# Altium schematic sheet 1_P1.schdoc
size 307 x 218 mm; Symbol: Drawing-Symbol_A4; Device: Drawing-Symbol_A4; @Project Name: smallest-microcontroller; @Page Count: 1; @Update Date: 2025-07-28; @Create Date: 2025-07-28; @Schematic Name: Schematic1; @Page No: 1; @Page Name: P1; Company: EasyEDA.com; Version: V1.0; Page Size: A4; @Create Time: 10:00:59; @Update Time: 11:22:58; Width: 1170; Height: 825; Region Start: 1; X Region Count: 6; Y Region Count: 4; Blade Width: 10; Title Block Position: 3; @Board Name: Board1
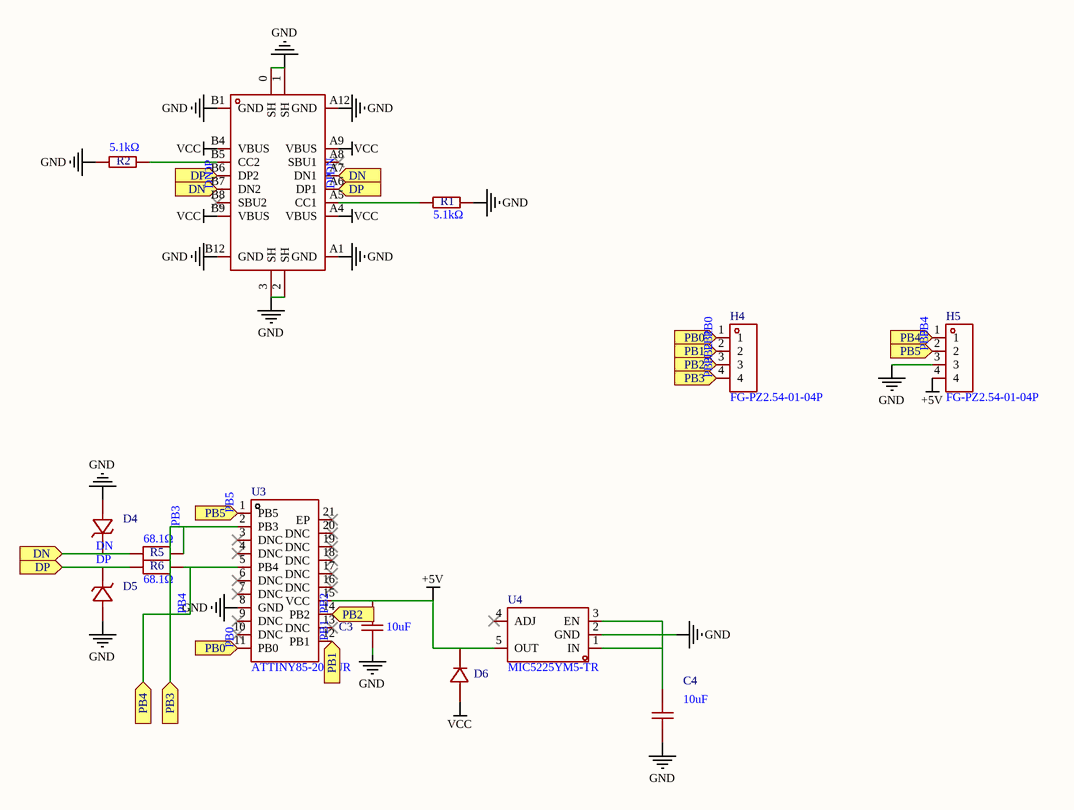
[diagram p0: 1_P1.schdoc]

## Parts
C3  10uF  [C0402]
C4  10uF  [C0402]
D4  BZT52C3V6  [SOD-123_L2.7-W1.6-LS3.7-RD-1]  (value not drawn)
D5  BZT52C3V6  [SOD-123_L2.7-W1.6-LS3.7-RD-1]  (value not drawn)
D6  NSR0320MW2T1G  [SOD-323_L1.8-W1.3-LS2.5-RD]  (value not drawn)
H4  FG-PZ2.54-01-04P  [HDR-TH_4P-P2.54-V-M]
H5  FG-PZ2.54-01-04P  [HDR-TH_4P-P2.54-V-M]
R1  5.1kΩ  [R0402]
R2  5.1kΩ  [R0402]
R5  68.1Ω  [R0402]
R6  68.1Ω  [R0402]
U3  ATTINY85-20MUR  [MLF-20_L4.0-W4.0-P0.50-BL-EP2.6]
U4  MIC5225YM5-TR  [SOT-23-5_L3.0-W1.7-P0.95-LS2.8-BL]
USBC1  TYPE-C-31-M-12  [USB-C_SMD-TYPE-C-31-M-12]  (value not drawn)

## Ports
DN (in), DP (in), PB0 (in), PB1 (in), PB2 (in), PB3 (in), PB4 (in), PB5 (in)

## Nets
+5V: C3.2 D6.1(C) H5.4 U3.15(VCC) U4.5(OUT)
GND: C3.1 C4.1 D4.2(A) D5.2(A) H5.3 R1.2 R2.1 U3.8(GND) U4.2(GND) USBC1.0(SH) USBC1.1(SH) USBC1.2(SH) USBC1.3(SH) USBC1.A1(GND) USBC1.A12(GND) USBC1.B1(GND) USBC1.B12(GND)
VCC: D6.2(A) USBC1.A4(VBUS) USBC1.A9(VBUS) USBC1.B4(VBUS) USBC1.B9(VBUS)
DN: D4.1(K) R5.1 USBC1.A7(DN1) USBC1.B7(DN2) ; port DN
DP: D5.1(K) R6.1 USBC1.A6(DP1) USBC1.B6(DP2) ; port DP
PB0: H4.1 U3.11(PB0) ; port PB0
PB1: H4.2 U3.12(PB1) ; port PB1
PB2: H4.3 U3.14(PB2) ; port PB2
PB3: H4.4 R5.2 U3.2(PB3) ; port PB3
PB4: H5.1 R6.2 U3.5(PB4) ; port PB4
PB5: H5.2 U3.1(PB5) ; port PB5
NetC4_2: C4.2 U4.1(IN) U4.3(EN)
NetR1_1: R1.1 USBC1.A5(CC1)
NetR2_2: R2.2 USBC1.B5(CC2)

Not connected (* = marked no-connect by the designer): U3 3(DNC)* 4(DNC)* 6(DNC)* 7(DNC)* 9(DNC)* 10(DNC)* 13(DNC)* 16(DNC)* 17(DNC)* 18(DNC)* 19(DNC)* 20(DNC)* 21(EP)*; U4 4(ADJ)*; USBC1 A8(SBU1)* B8(SBU2)*

## Notes on the sheet
- 1
- 2
- 3
- 4
- 5
- 6
- A
- B
- C
- Schematic
- Schematic1
- Create at
- Update at
- 2025-07-28
- Board
- Drawn
- Board1
- Page
- P1
- D
- Reviewed
- Version
- Size
- smallest-microcontroller
- Page  1  Total  1
- V1.0
- A4
- EasyEDA.com

## Library data of the parts
C3 C4 = CL05A106MQ8NUB8: Manufacturer: SAMSUNG(三星); Add into BOM: yes; Tolerance: ±20%; Voltage Rating: 6.3V; Temperature Coefficient: X5R; Symbol: CL05A106MQ8NUB8; Device: CL05A106MQ8NUB8; LCSC Part Name: 10uF ±20% 6.3V; Supplier Part: C307416; Manufacturer Part: CL05A106MQ8NUB8; Supplier Footprint: 0402; JLCPCB Part Class: Extended Part; Datasheet: https://atta.szlcsc.com/upload/public/pdf/source/20160218/1457707763339.pdf; Supplier: LCSC; Convert to PCB: yes; Value: 10uF
D4 D5 = BZT52C3V6_C2891771: Manufacturer: YONGYUTAI(永裕泰); Add into BOM: yes; Zener Voltage (Nom): 3.6V; Reverse Leakage Current (Ir): 5uA@1V; Zener Voltage (Range): 3.6V~3.8V; Power Dissipation: 500mW; Zener Impedance (Zzt): 90Ω; Symbol: BZT52C3V6_C2891771; Device: BZT52C3V6_C2891771; LCSC Part Name: BZT52C3V6; Supplier Part: C2891771; Manufacturer Part: BZT52C3V6; Supplier Footprint: SOD-123; JLCPCB Part Class: Extended Part; Datasheet: https://atta.szlcsc.com/upload/public/pdf/source/20210901/8FC2376A01E96D0346FF8B134DC7A446.pdf; Supplier: LCSC; Convert to PCB: yes; Diode Configuration: -
D6 = NSR0320MW2T1G: Manufacturer: onsemi(安森美); Add into BOM: yes; Forward Voltage (Vf@If): 500mV@900mA; Reverse Voltage (Vr): 20V; Average Rectified Current (Io): 1A; Reverse Leakage Current (Ir): 50uA@15V; Symbol: NSR0320MW2T1G; Device: NSR0320MW2T1G; LCSC Part Name: 电压:20V 电流:1A; Supplier Part: C48192; Manufacturer Part: NSR0320MW2T1G; Supplier Footprint: SOD-323; JLCPCB Part Class: Extended Part; Datasheet: https://atta.szlcsc.com/upload/public/pdf/source/20170225/1488010654203.PDF; Supplier: LCSC; Convert to PCB: yes
H4 H5 = FG-PZ2.54-01-04P: Manufacturer: FG(富港); Add into BOM: yes; Pin Structure: 1x4P; Pitch: 2.54mm; Circluar Pins/Square Pins: Policy; Symbol: FG-PZ2.54-01-04P; Device: FG-PZ2.54-01-04P; LCSC Part Name: 1x4P 间距:2.54mm 方针; Supplier Part: C42391438; Manufacturer Part: FG-PZ2.54-01-04P; Supplier Footprint: 插件,P=2.54mm; Datasheet: https://atta.szlcsc.com/upload/public/pdf/source/20241210/62A19982ADC8F0BCD0D04222BA2B3C60.pdf; Supplier: LCSC; Convert to PCB: yes; Number of Rows: Single Row
R1 R2 = RMC04025.1K5%N: Manufacturer: Tyohm(幸亚电阻); Add into BOM: yes; Tolerance: ±5%; Symbol: RMC04025.1K5%N; Device: RMC04025.1K5%N; LCSC Part Name: 5.1kΩ ±5% 62.5mW; Supplier Part: C325524; Manufacturer Part: RMC04025.1K5%N; Supplier Footprint: 0402; JLCPCB Part Class: Extended Part; Datasheet: https://atta.szlcsc.com/upload/public/pdf/source/20190115/C325956_D27151D492FFB3C9AB4A6F14FE01F30A.pdf; Supplier: LCSC; Convert to PCB: yes; Value: 5.1kΩ
R5 R6 = CR0402F68R1Q10: Manufacturer: EVER OHMS(天二科技); Add into BOM: yes; Tolerance: ±1%; Temperature Coefficient: ±300ppm/℃; Symbol: CR0402F68R1Q10; Device: CR0402F68R1Q10; LCSC Part Name: 厚膜电阻 68.1Ω ±1% 63mW; Supplier Part: C429058; Manufacturer Part: CR0402F68R1Q10; Supplier Footprint: 0402; JLCPCB Part Class: Extended Part; Datasheet: https://atta.szlcsc.com/upload/public/pdf/source/20200113/C482024_EFFFA47EA0B3A01639CDA1264BD0AF46.pdf; Supplier: LCSC; Convert to PCB: yes; Type: Thick Film Resistors; Value: 68.1Ω; Operating Temperature Range: -55℃~+155℃
U3 = ATTINY85-20MUR_C612955: Manufacturer: MICROCHIP(美国微芯); Add into BOM: yes; CPU Core: AVR; Program Storage Size: 8KB; GPIO Ports Number: 6; Operating Voltage Range: 2.7V~5.5V; CPU Maximum Speed: 20MHz; Program Memory Type: FLASH; EEPROM: 512Byte; ADC (Bit): 10bit; Peripheral/Function: PWM; Watchdog: 有; Symbol: ATTINY85-20MUR; Device: ATTINY85-20MUR_C612955; LCSC Part Name: ATTINY85-20MUR; Supplier Part: C612955; Manufacturer Part: ATTINY85-20MUR; Supplier Footprint: WFQFN-20-EP(4x4); JLCPCB Part Class: Extended Part; Datasheet: https://atta.szlcsc.com/upload/public/pdf/source/20221014/9CE92D0F01EE486E0EE89BDE22021A80.pdf; Supplier: LCSC; Convert to PCB: yes; Operating Temperature Range: -40℃~+85℃; DAC (Bit): -; PWM (Bit): -; Universal Serial Bus: -; Internal Comparator: -; communication protocol: -; Real-Time Clock: -; Infrared Data Association: -; Low-Voltage Detect: 有; CCP Capture/Compare: -; Secure Digital Input and Output: -; Direct Memory Access: -; Internal Oscillator: 有
U4 = MIC5225YM5-TR: Manufacturer: MICROCHIP(美国微芯); Add into BOM: yes; Output Type: Adjustable; Maximum Input Voltage: 16V; Output Voltage: 1.24V~14V; Output Current: 150mA; Dropout Voltage: 450mV@(150mA); Output Polarity: Positive electrode; Number of Outputs: 1; Symbol: MIC5225YM5-TR; Device: MIC5225YM5-TR; LCSC Part Name: ADJ 输入16V 输出1.24V~14V 150mA; Supplier Part: C220796; Manufacturer Part: MIC5225YM5-TR; Supplier Footprint: SOT-23-5; JLCPCB Part Class: Extended Part; Datasheet: https://atta.szlcsc.com/upload/public/pdf/source/20180530/C220796_5519F91F6DDEF7ACF49E42913CDA0F8A.pdf; Supplier: LCSC; Convert to PCB: yes; Power Supply Rejection Ratio (PSRR): -; Feature: ESD Protection；Thermal Protection(TSD)；Anti-Reverse；Overcurrent Protection(OCP)；With ability; Operating Temperature: -40℃~+125℃
USBC1 = TYPE-C-31-M-12: Manufacturer: 韩国韩荣; Add into BOM: yes; Connector Type: Type-C; Gender: Female; Number of Contacts: 16P; Number of Ports: 1; Current Rating - Power (Max): 5A; Symbol: TYPE-C-31-M-12; Device: TYPE-C-31-M-12; LCSC Part Name: Type-C 母; Supplier Part: C165948; Manufacturer Part: TYPE-C-31-M-12; Supplier Footprint: SMD; JLCPCB Part Class: Extended Part; Datasheet: https://atta.szlcsc.com/upload/public/pdf/source/20220525/466408E853115E789EDB0DDC29077C05.pdf; Supplier: LCSC; Convert to PCB: yes; Standard: -; Mounting Style: -; Operating Temperature Range: -